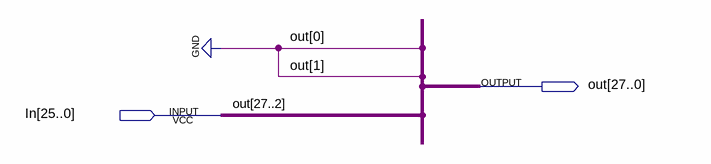
[diagram p0: schematic sheet]
// Quartus schematic TwoSevenBitShifter.bdf as structural Verilog: 0 symbols, 2 pins
module TwoSevenBitShifter (
  input  [25:0] In,
  output [27:0] out
);


  assign out = {In, 2'b00};
endmodule
